# EAGLE design TDA5051A_DC_LC_PLCModem (EAGLE 9.4.2)
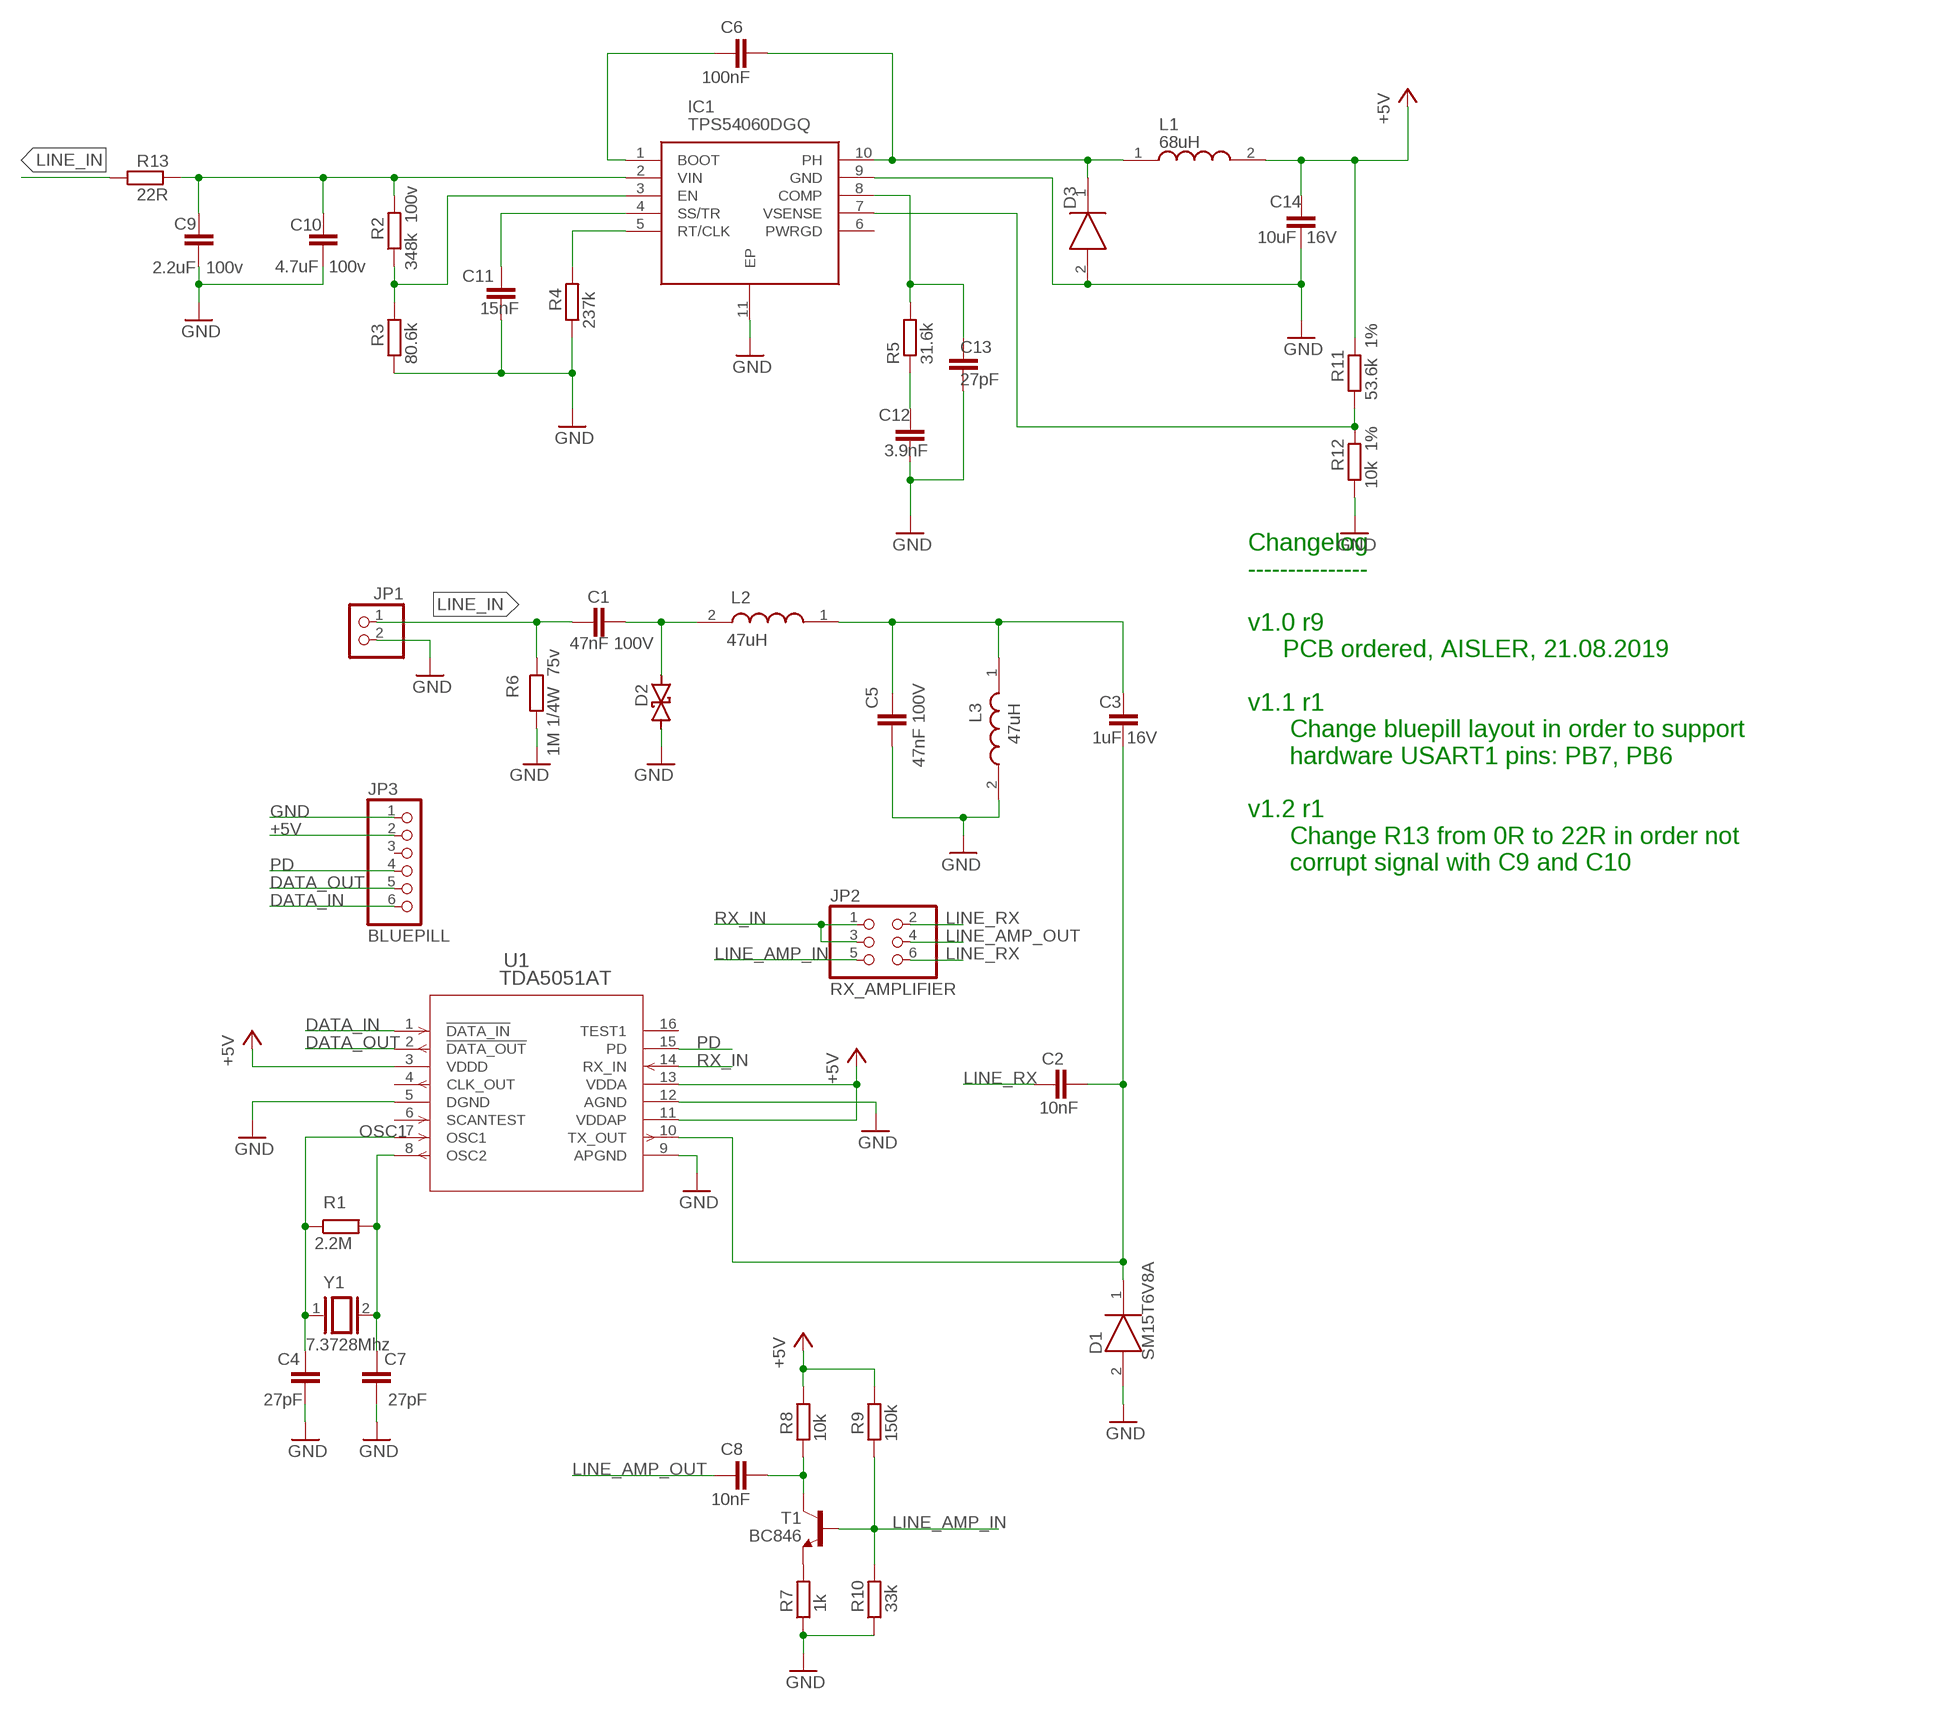
[diagram p0: schematic, sheet 1]

## Parts
C1  47nF 100V  C-EUC1206  [C1206]
C2  10nF  C-EUC0603  [C0603]
C3  1uF 16V  C-EUC0805  [C0805]
C4  27pF  C-EUC0603  [C0603]
C5  47nF 100V  C-EUC1206  [C1206]
C6  100nF  C-EUC0603  [C0603]
C7  27pF  C-EUC0603  [C0603]
C8  10nF  C-EUC0603  [C0603]
C9  2.2uF 100v  C-EUC1210  [C1210]
C10  4.7uF 100v  C-EUC1210  [C1210]
C11  15nF  C-EUC0603  [C0603]
C12  3.9nF  C-EUC0603  [C0603]
C13  27pF  C-EUC0603  [C0603]
C14  10uF 16V  C-EUC0603  [C0603]
D1  SM15T6V8A  [DIOM8059X265N]
D2  SM15T6V8CA  [DIOM8059X265N]
D3  STPS2H100A  [DIOM5126X265N]
IC1  TPS54060DGQ  [SOP50P490X110-11N]
JP1  PINHD-1X2  [1X02]
JP2  RX_AMPLIFIER  PINHD-2X3  [2X03]
JP3  BLUEPILL  PINHD-1X6  [1X06]
L1  68uH  SDR0805-680KL  [SDR0805-680KL]
L2  47uH  SDR1307-470KL  [SDR1307-220ML]
L3  47uH  SDR1307-470KL  [SDR1307-220ML]
R1  2.2M  R-EU_R0603  [R0603]
R2  348k 100v  R-EU_R0603  [R0603]
R3  80.6k  R-EU_R0603  [R0603]
R4  237k  R-EU_R0603  [R0603]
R5  31.6k  R-EU_R0603  [R0603]
R6  1M 1/4W 75v  R-EU_R0603  [R0603]
R7  1k  R-EU_R0603  [R0603]
R8  10k  R-EU_R0603  [R0603]
R9  150k  R-EU_R0603  [R0603]
R10  33k  R-EU_R0603  [R0603]
R11  53.6k 1%  R-EU_R0603  [R0603]
R12  10k 1%  R-EU_R0603  [R0603]
R13  22R  R-EU_R0603  [R0603]
T1  BC846  [SOT23]
U1  TDA5051AT  [SOT162-1]
Y1  7.3728Mhz  ABLS-7.3728MHZ-B2-T  [HC/49US_(AT49)]

## Nets
+5V [power]: C14.1 JP3.2 L1.2 R8.2 R9.2 R11.2 U1.3(VDDD) U1.11(VDDAP) U1.13(VDDA)
DATA_IN: JP3.6 U1.1(!DATA_IN)
DATA_OUT: JP3.5 U1.2(!DATA_OUT)
GND [power]: C4.1 C5.1 C7.1 C9.2 C10.2 C11.2 C12.2 C13.2 C14.2 D1.2(A) D2.2 D3.2(A) IC1.9(GND) IC1.11(EP) JP1.2 JP3.1 L3.2 R3.1 R4.1 R6.2 R7.1 R10.1 R12.1 U1.5(DGND) U1.9(APGND) U1.12(AGND)
LINE_AMP_IN: JP2.5 R9.1 R10.2 T1.1(B)
LINE_AMP_OUT: C8.1 JP2.4
LINE_IN [power]: C1.1 JP1.1 R6.1 R13.1
LINE_IN1 [power]: C9.1 C10.1 IC1.2(VIN) R2.2 R13.2
LINE_RX: C2.1 JP2.2 JP2.6
N$1: C2.2 C3.2 D1.1(K) U1.10(TX_OUT)
N$2 [power]: C1.2 D2.1 L2.2
N$3 [power]: C3.1 C5.2 L2.1 L3.1
N$4: C8.2 R8.1 T1.3(C)
N$5: C6.1 IC1.1(BOOT)
N$6 [power]: C6.2 D3.1(K) IC1.10(PH) L1.1
N$8: R7.2 T1.2(E)
N$10: C7.2 R1.2 U1.8(OSC2) Y1.2
N$11: IC1.3(EN) R2.1 R3.2
N$13: IC1.5(RT/CLK) R4.2
N$14: C11.1 IC1.4(SS/TR)
N$15: C12.1 R5.1
N$16: C13.1 IC1.8(COMP) R5.2
N$18: IC1.7(VSENSE) R11.1 R12.2
OSC1: C4.2 R1.1 U1.7(OSC1) Y1.1
PD: JP3.4 U1.15(PD)
RX_IN: JP2.1 JP2.3 U1.14(RX_IN)
Unconnected: IC1.6(PWRGD) JP3.3 U1.4(CLK_OUT) U1.6(SCANTEST)

## Notes on the sheet
- Changelog
  ---------------
  
  v1.0 r9
       PCB ordered, AISLER, 21.08.2019
  
  v1.1 r1
        Change bluepill layout in order to support
        hardware USART1 pins: PB7, PB6
  
  v1.2 r1
        Change R13 from 0R to 22R in order not
        corrupt signal with C9 and C10

## Power pins joined to a net without a drawn wire
TEST1: U1.16(TEST1)

## Library data of the parts
C1 C5 = rcl:C-EU: CAPACITOR, European symbol; MF: KEMET; MPN: C1206C473K1RACAUTO; OC_MOUSER: 80-C1206C473K1RAUTO; SPICEPREFIX: C
C2 C8 = rcl:C-EU: CAPACITOR, European symbol; MF: KEMET; MPN: C0603C103K5RACAUTO7411; OC_MOUSER: 80-C0603C103K5RAUTLR; SPICEPREFIX: C
C3 = rcl:C-EU: CAPACITOR, European symbol; MF: KEMET; MPN: C0805C105K4RACAUTO; OC_MOUSER: 80-C0805C105K4RAUTO; SPICEPREFIX: C
C4 C7 C13 = rcl:C-EU: CAPACITOR, European symbol; MF: AVX; MPN: 06035A270JAT2A; OC_MOUSER: 581-06035A270J; SPICEPREFIX: C
C6 = rcl:C-EU: CAPACITOR, European symbol; MF: KEMET; MPN: C0603C104K5RECAUTO; OC_MOUSER: 80-C0603C104K5REAUTO; SPICEPREFIX: C
C9 = rcl:C-EU: CAPACITOR, European symbol; MF: TDK; MPN: C3225X7R2A225K230AB; OC_MOUSER: 810-C3225X7R2A225K; SPICEPREFIX: C
C10 = rcl:C-EU: CAPACITOR, European symbol; MF: TDK; MPN: CGA6M3X7S2A475K200AB; OC_MOUSER: 810-CGA6M3X7S2A475K; SPICEPREFIX: C
C11 = rcl:C-EU: CAPACITOR, European symbol; MF: AVX; MPN: 06035C153KAT2A; OC_MOUSER: 581-06035C153K; SPICEPREFIX: C
C12 = rcl:C-EU: CAPACITOR, European symbol; MF: Murata Electronics; MPN: GCM1885C1H392JA16D; OC_MOUSER: 81-GCM1885C1H392JA6D; SPICEPREFIX: C
C14 = rcl:C-EU: CAPACITOR, European symbol; MF: Murata Electronics; MPN: GRM188R61C106KAALD; OC_MOUSER: 81-GRM188R61C106KALD; SPICEPREFIX: C
D1 = SM15T6V8A:SM15T6V8A: TVS Diode Uni-Directional SM15T6V8A 13.4V, 1500W, SMC 2-Pin Source: Datasheet <https://componentsearchengine.com/Datasheets/1/SM15T6V8A.pdf>; DESCRIPTION: TVS Diode Uni-Directional SM15T6V8A 13.4V, 1500W, SMC 2-Pin; HEIGHT: 2.65mm; MANUFACTURER_NAME: STMicroelectronics; MANUFACTURER_PART_NUMBER: SM15T6V8A; MF: STMicroelectronics; MOUSER_PART_NUMBER: 511-SM15T6V8A; MOUSER_PRICE-STOCK: https://www.mouser.com/Search/Refine.aspx?Keyword=511-SM15T6V8A; MPN: SM15T6V8A; OC_MOUSER: 511-SM15T6V8A
D2 = SM15T6V8CA:SM15T6V8CA: TVS Diode Bi-Directional SM15T6V8CA 13.4V, 1500W, SMC 2-Pin Source: Datasheet <https://componentsearchengine.com/Datasheets/1/SM15T6V8CA.pdf>; DESCRIPTION: TVS Diode Bi-Directional SM15T6V8CA 13.4V, 1500W, SMC 2-Pin; HEIGHT: 2.65mm; MANUFACTURER_NAME: STMicroelectronics; MANUFACTURER_PART_NUMBER: SM15T6V8CA; MF: STMicroelectronics; MOUSER_PART_NUMBER: 511-SM15T6V8CA; MOUSER_PRICE-STOCK: https://www.mouser.com/Search/Refine.aspx?Keyword=511-SM15T6V8CA; MPN: SM15T6V8CA; OC_MOUSER: 511-SM15T6V8CA
D3 = STPS2H100A:STPS2H100A: STPS2H100A, Schottky Diode, 2A max, 100V, 2-Pin, SMA Source: Datasheet <https://componentsearchengine.com/Datasheets/1/STPS2H100A.pdf>; DESCRIPTION: STPS2H100A, Schottky Diode, 2A max, 100V, 2-Pin, SMA; HEIGHT: 2.65mm; MANUFACTURER_NAME: STMicroelectronics; MANUFACTURER_PART_NUMBER: STPS2H100A; MF: STMicroelectronics; MOUSER_PART_NUMBER: 511-STPS2H100A; MOUSER_PRICE-STOCK: https://www.mouser.com/Search/Refine.aspx?Keyword=511-STPS2H100A; MPN: STPS2H100A; OC_MOUSER: 511-STPS2H100A
IC1 = TPS54060DGQ:TPS54060DGQ: 3.5V to 60V Input, 0.5A Step-Down Converter with Eco-Mode Source: Datasheet <http://www.ti.com/lit/ds/symlink/tps54060.pdf>; DESCRIPTION: 3.5V to 60V Input, 0.5A Step-Down Converter with Eco-Mode; HEIGHT: 1.1mm; MANUFACTURER_NAME: Texas Instruments; MANUFACTURER_PART_NUMBER: TPS54060DGQ; MF: Texas Instruments; MOUSER_PART_NUMBER: 595-TPS54060DGQ; MOUSER_PRICE-STOCK: https://www.mouser.com/Search/Refine.aspx?Keyword=595-TPS54060DGQ; MPN: TPS54060DGQR; OC_MOUSER: 595-TPS54060DGQR
JP1 = pinhead:PINHD-1X2: PIN HEADER; OC_MOUSER: unknown
JP2 = pinhead:PINHD-2X3: PIN HEADER; OC_MOUSER: unknown
JP3 = adafruit:PINHD-1X6: PIN HEADER; MF: Harwin; MPN: M20-7820646; OC_MOUSER: 855-M20-7820646
L1 = SDR0805-680KL:SDR0805-680KL: Bourns SDR0805 Series Wire-wound SMD Inductor with a Ferrite Core, 68uH +/-10% 850mA Idc Source: Datasheet <https://componentsearchengine.com/Datasheets/1/SDR0805-680KL.pdf>; DESCRIPTION: Bourns SDR0805 Series Wire-wound SMD Inductor with a Ferrite Core, 68 uH +/-10% 850mA Idc; HEIGHT: mm; MANUFACTURER_NAME: Bourns; MANUFACTURER_PART_NUMBER: SDR0805-680KL; MF: Bourns; MOUSER_PART_NUMBER: 652-SDR0805-680KL; MOUSER_PRICE-STOCK: https://www.mouser.com/Search/Refine.aspx?Keyword=652-SDR0805-680KL; MPN: SDR0805-680KL; OC_MOUSER: 652-SDR0805-680KL
L2 = SDR1307-470KL:SDR1307-470KL: BOURNS - SDR1307-470KL - INDUCTOR, 47UH, 10%, 2.7A, SMD Source: Datasheet <https://componentsearchengine.com/Datasheets/1/SDR1307-470KL.pdf>; DESCRIPTION: BOURNS - SDR1307A-470K - INDUCTOR, 47UH, 10%, 4.2A, SMD; HEIGHT: mm; MANUFACTURER_NAME: Bourns; MANUFACTURER_PART_NUMBER: SDR1307A-470K; MF: Bourns; MOUSER_PART_NUMBER: 652-SDR1307A-470K; MOUSER_PRICE-STOCK: https://www.mouser.com/Search/Refine.aspx?Keyword=652-SDR1307A-470K; MPN: SDR1307A-470K; OC_MOUSER: 652-SDR1307A-470K
L3 = SDR1307-470KL:SDR1307-470KL: BOURNS - SDR1307-470KL - INDUCTOR, 47UH, 10%, 2.7A, SMD Source: Datasheet <https://componentsearchengine.com/Datasheets/1/SDR1307-470KL.pdf>; DESCRIPTION: BOURNS - SDR1307A-470K - INDUCTOR, 47UH, 10%, 4.2A, SMD; HEIGHT: mm; MANUFACTURER_NAME: Bourns; MANUFACTURER_PART_NUMBER: SDR1307A-470K; MF: Bourns; MOUSER_PART_NUMBER: 652-SDR1307A-470K; MOUSER_PRICE-STOCK: https://www.mouser.com/Search/Refine.aspx?Keyword=652-SDR1307A-470K; MPN: SDR1307A-470K; OC_MOUSER: 652-SDR1307A-470K; SPICEPREFIX: L
R1 = rcl:R-EU_: RESISTOR, European symbol; MF: Yageo; MPN: RC0603JR-072M2L; OC_MOUSER: 603-RC0603JR-072M2L; SPICEPREFIX: R
R2 = rcl:R-EU_: RESISTOR, European symbol; MF: Susumu; MPN: RG1608P-3483-D-T5; OC_MOUSER: 754-RG1608P-3483DT5; SPICEPREFIX: R
R3 = rcl:R-EU_: RESISTOR, European symbol; MF: Vishay / Dale; MPN: CRCW060380K6FKEA; OC_MOUSER: 71-CRCW0603-80.6K-E3; SPICEPREFIX: R
R4 = rcl:R-EU_: RESISTOR, European symbol; MF: Yageo; MPN: AC0603FR-07237KL; OC_MOUSER: 603-AC0603FR-07237KL; SPICEPREFIX: R
R5 = rcl:R-EU_: RESISTOR, European symbol; MF: Yageo; MPN: AC0603FR-0731K6L; OC_MOUSER: 603-AC0603FR-0731K6L; SPICEPREFIX: R
R6 = rcl:R-EU_: RESISTOR, European symbol; MF: Vishay / Dale; MPN: RCS06031M00FKEA; OC_MOUSER: 71-RCS06031M00FKEA; SPICEPREFIX: R
R7 = rcl:R-EU_: RESISTOR, European symbol; MF: Vishay / Dale; MPN: CRCW06031K00FKEAC; OC_MOUSER: 71-CRCW06031K00FKEAC; SPICEPREFIX: R
R8 R12 = rcl:R-EU_: RESISTOR, European symbol; MF: Vishay / Dale; MPN: CRCW060310K0FKEAC; OC_MOUSER: 71-CRCW060310K0FKEAC; SPICEPREFIX: R
R9 = rcl:R-EU_: RESISTOR, European symbol; MF: Yageo; MPN: RC0603FR-07150KL; OC_MOUSER: 603-RC0603FR-07150KL; SPICEPREFIX: R
R10 = rcl:R-EU_: RESISTOR, European symbol; MF: Yageo; MPN: RC0603FR-0733KL; OC_MOUSER: 603-RC0603FR-0733KL; SPICEPREFIX: R
R11 = rcl:R-EU_: RESISTOR, European symbol; MF: Yageo; MPN: RC0603FR-0753K6L; OC_MOUSER: 603-RC0603FR-0753K6L; SPICEPREFIX: R
R13 = rcl:R-EU_: RESISTOR, European symbol; MF: Yageo; MPN: RC0603JR-070RL; OC_MOUSER: 603-RC0603JR-070RL; SPICEPREFIX: R
T1 = transistor:BC846: NPN TRANSISTOR; MF: ON Semiconductor; MPN: BC846BLT1G; OC_MOUSER: 863-BC846BLT1G; SPICEPREFIX: J
U1 = TDA5051A:TDA5051AT; MANUFACTURER_PART_NUMBER: TDA5051AT; MF: NXP Semiconductors; MPN: TDA5051AT/C1,518; OC_MOUSER: 771-TDA5051ATD-T; VENDOR: NXP
Y1 = ABLS-7.3728MHZ-B2-T:ABLS-7.3728MHZ-B2-T: Quarze +/-20ppm 7.3728 MHZ FUNDAMENTAL Source: Datasheet <https://componentsearchengine.com/Datasheets/1/ABLS-7.3728MHZ-B2-T.pdf>; DESCRIPTION: Quarze +/-20ppm 7.3728 MHZ FUNDAMENTAL; HEIGHT: mm; MANUFACTURER_NAME: ABRACON; MANUFACTURER_PART_NUMBER: ABLS-7.3728MHZ-B2-T; MF: ABRACON; MOUSER_PART_NUMBER: 815-ABLS-7.3728-B2; MOUSER_PRICE-STOCK: https://www.mouser.com/Search/Refine.aspx?Keyword=815-ABLS-7.3728-B2; MPN: ABLS-7.3728MHZ-B2-T; OC_MOUSER: 815-ABLS-7.3728-B2

## Net classes
0 default: width 0.203 mm
1 power: width 0.254 mm

## Board
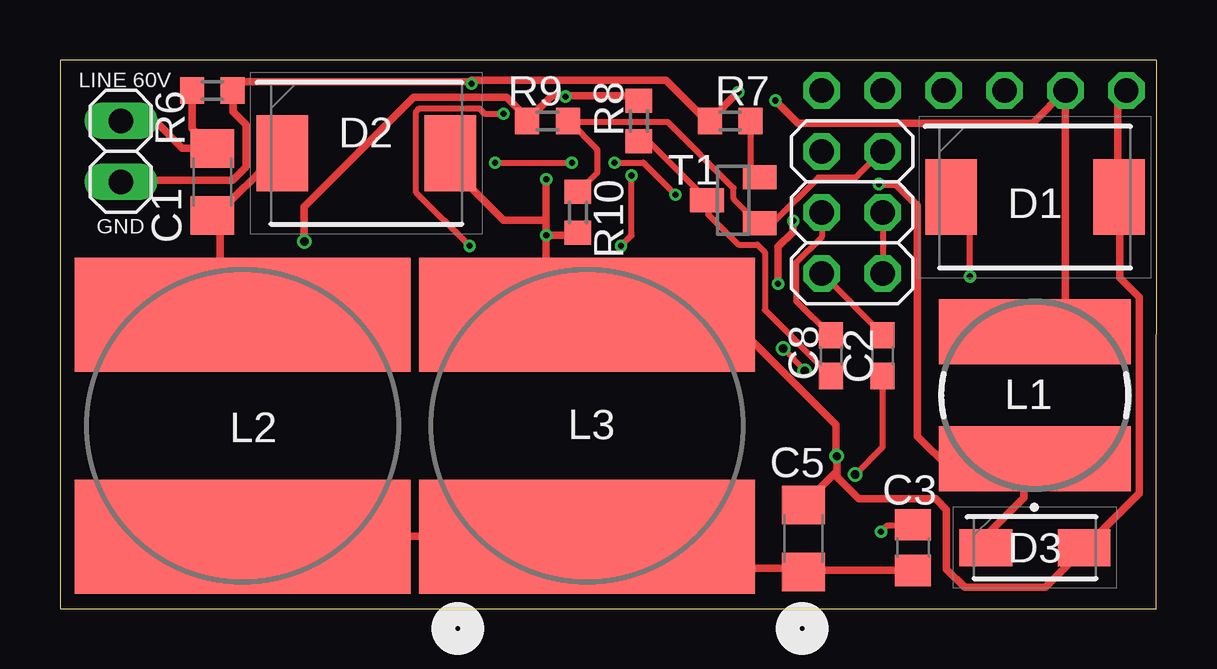
[diagram p1: board, top side]
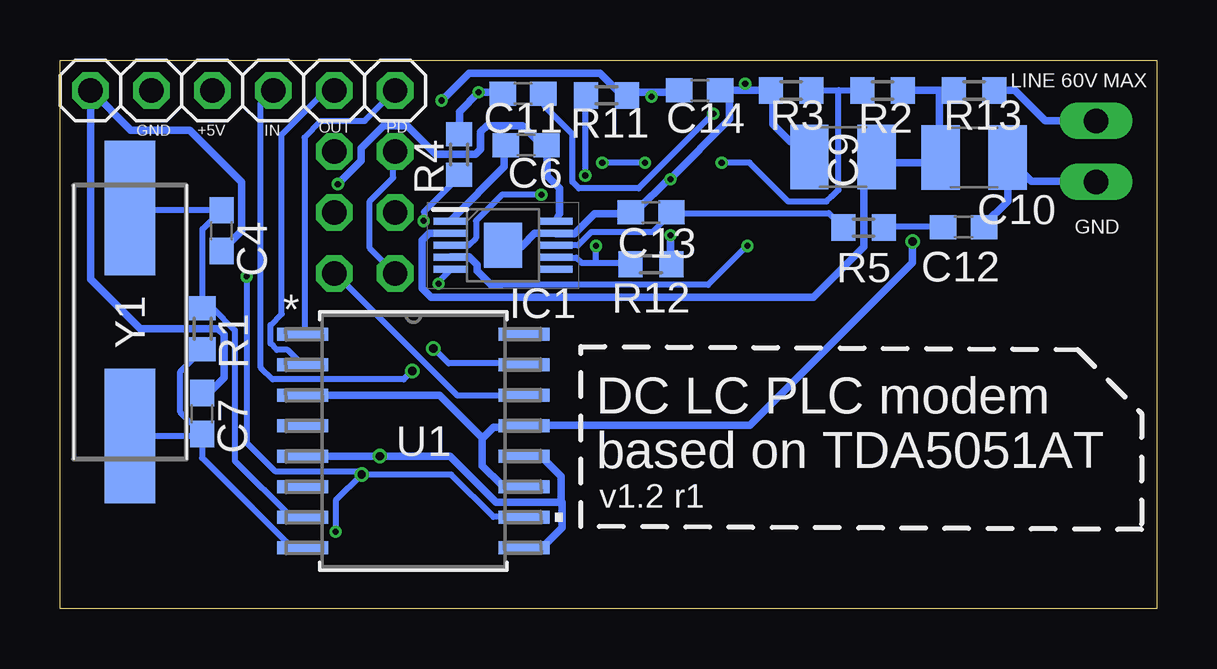
[diagram p2: board, bottom side, seen from below]

Size 45.72 x 22.86 mm. Coordinates in mm from the lower left corner, seen from the top.
Outline: 0,0 45.7,0 45.72,22.86 0,22.86 0,0
Copper layers (1*16): Top 0.035559375mm / dielectric 1.6mm / Bottom 0.035559375mm
Design rules "oshpark-2layer": minimum track width 6mil, minimum drill 10mil, track to track 6mil, track to pad 6mil, pad to pad 6mil, via to via 6mil, smd to smd 6mil, copper to edge 15mil, drill to drill 6mil, minimum pad ring 5mil, minimum via ring 5mil, stop-mask expansion 2.5mil, vias tented up to drill 0mil, thermal gap 10mil

### Footprints (pad centres in the part's own frame; a part is rotated, then mirrored left to right if it is on the bottom)
C1206 = smd 1.6 x 1.8: 1 -1.4,0; 2 1.4,0
C0603 = smd 1.1 x 1: 1 -0.85,0; 2 0.85,0
C0805 = smd 1.3 x 1.5: 1 -0.95,0; 2 0.95,0
C1210 = smd 1.6 x 2.7: 1 -1.4,0; 2 1.4,0
DIOM8059X265N = smd 2.15 x 3.15: 1 -3.5,0; 2 3.5,0
DIOM5126X265N = smd 2.2 x 1.55: 1 -2.05,0; 2 2.05,0
SOP50P490X110-11N = smd 1.4 x 0.3: 1 -2.2,1; 2 -2.2,0.5; 3 -2.2,0; 4 -2.2,-0.5; 5 -2.2,-1; 6 2.2,-1; 7 2.2,-0.5; 8 2.2,0; 9 2.2,0.5; 10 2.2,1 | smd 1.57 x 1.88: 11 0,0
1X02 = drill 1.016 long: 1 -1.27,0; 2 1.27,0
2X03 = drill 1.016 octagon: 1 -2.54,-1.27; 2 -2.54,1.27; 3 0,-1.27; 4 0,1.27; 5 2.54,-1.27; 6 2.54,1.27
1X06 = drill 1.016 octagon: 1 -6.35,0; 2 -3.81,0; 3 -1.27,0; 4 1.27,0; 5 3.81,0; 6 6.35,0
SDR0805-680KL = smd 8 x 2.7: 1 0,2.65; 2 0,-2.65
SDR1307-220ML = smd 14 x 4.75: 1 0,4.625; 2 0,-4.625
R0603 = smd 1 x 1.1: 1 -0.85,0; 2 0.85,0
SOT23 = smd 1 x 1.4: 1 -0.95,-1.1; 2 0.95,-1.1; 3 0,1.1
SOT162-1 = smd 2.121 x 0.533: 1 -4.616,4.445; 2 -4.616,3.175; 3 -4.616,1.905; 4 -4.616,0.635; 5 -4.616,-0.635; 6 -4.616,-1.905; 7 -4.616,-3.175; 8 -4.616,-4.445; 9 4.616,-4.445; 10 4.616,-3.175; 11 4.616,-1.905; 12 4.616,-0.635; 13 4.616,0.635; 14 4.616,1.905; 15 4.616,3.175; 16 4.616,4.445
HC/49US_(AT49) = smd 5.6 x 2.1: 1 -4.75,0; 2 4.75,0

### Placement (x,y rotation side)
C1  6.35,17.78 270 top
C2  34.29,10.54 270 top
C3  35.56,2.54 90 top
C4  38.99,15.75 90 bottom
C5  30.99,2.92 270 top
C6  26.29,19.3 0 bottom
C7  39.8,8.13 270 bottom
C8  32.13,10.54 270 top
C9  13.08,18.82 180 bottom
C10  7.62,18.8 0 bottom
C11  26.42,21.46 180 bottom
C12  8.05,15.9 0 bottom
C13  21.08,16.51 180 bottom
C14  19.05,21.59 0 bottom
D1  40.64,17.14 0 top
D2  12.78,18.97 0 top
D3  40.64,2.54 0 top
IC1  27.25,15.14 0 bottom
JP1  2.54,19.05 270 top
JP2  33.02,16.51 90 top
JP3  38.1,21.59 0 bottom
L1  40.64,8.89 180 top
L2  7.62,7.62 180 top
L3  21.97,7.62 180 top
R1  39.78,11.66 270 bottom
R2  11.43,21.59 0 bottom
R3  15.24,21.59 0 bottom
R4  29.08,18.92 270 bottom
R5  12.22,15.88 180 bottom
R6  6.35,21.59 0 top
R7  27.94,20.32 0 top
R8  24.13,20.32 90 top
R9  20.32,20.32 180 top
R10  21.59,16.51 90 top
R11  22.94,21.39 0 bottom
R12  21.08,14.35 180 bottom
R13  7.62,21.59 180 bottom
T1  28.07,17.02 90 top
U1  30.99,6.99 0 bottom
Y1  42.8,11.94 270 bottom

### Tracks (layer width: path | path; a pad name or v marks a point on that pad's centre or on a via)
+5V  (via drill 0.25, 0.35)
  Top 0.305: R8.2 23.94,21.36 21.09,21.36 v21.07,21.34 21.04,21.36 20.51,21.36 R9.2 19.47,20.45 18.61,21.31 14.74,21.31 10.19,16.75 v10.19,15.29 | v29.82,21.17 30.76,20.23 40.55,20.23 JP3.2 41.91,12.81 L1.2
  Bottom 0.305: 28.11,7.1 27.65,7.56 26.4,7.56 U1.13 26.31,7.64 16.95,7.64 10.19,14.41 v10.19,15.29 | U1.11 26.4,5.16 27.32,5.16 28.12,5.96 28.12,7.09 28.11,7.1 | U1.3 29.9,8.89 28.11,7.1 | 21.07,21.51 22.08,21.51 R11.2 22.22,21.6 22.49,21.6 23.2,22.31 28.68,22.31 v29.82,21.17 | 21.07,21.51 19.91,21.51 C14.1 | v21.07,21.34 21.07,21.51
DATA_IN
  Bottom 0.254: JP3.6 33.02,20.32 34.85,20.32 35.53,19.64 35.53,11.51 U1.1
DATA_OUT
  Bottom 0.254: U1.2 36.23,10.78 36.68,10.78 36.94,11.05 36.94,11.81 36.47,12.28 36.47,19.74 34.62,21.59 JP3.5
GND  (via drill 0.25, 0.35)
  Top 0.305: v28.27,21.51 27.11,20.36 R7.1 27.03,20.45 26.82,20.45 25.26,22.01 17.16,22.01 17.16,21.96 | 17.16,21.96 7.64,21.96 7.29,21.6 R6.2 7.2,21.51 7.23,21.49 7.23,20.7 7.76,20.17 7.76,18.4 7.2,17.84 2.6,17.84 JP1.2 | v17.16,21.87 17.16,21.96 | v20.27,15.56 20.27,16.09 20.18,16.18 18.49,16.18 16.28,18.39 D2.2 | v20.27,15.56 20.26,15.54 20.26,13.97 21.96,12.27 L3.2 27.76,12.24 32.34,7.66 32.34,6.31 v32.38,6.35 | 42.76,2.58 44.98,4.8 44.98,12.98 44.18,13.78 44.18,17.07 D1.2 44.09,17.16 44.09,21.23 JP3.1 | 42.76,2.58 D3.2 | v32.38,6.35 32.38,5.49 33.3,4.57 36.5,4.57 36.96,4.12 36.96,1.65 37.72,0.89 41.07,0.89 42.76,2.58 | v32.38,6.35 32.38,5.72 C5.1 | v20.27,15.56 21.49,15.56 R10.1 | v20.27,15.56 v20.27,17.89
  Bottom 0.305: IC1.11 27.2,15.09 26.48,15.09 25.93,15.63 IC1.9 25.04,15.62 24.27,15.62 23.44,16.45 21.96,16.45 C13.2 21.74,16.51 20.27,17.98 20.27,17.92 | 17.16,21.6 18.14,21.6 C14.2 17.8,21.47 17.8,20.38 20.27,17.92 | 17.16,21.6 16.09,21.6 R3.1 16,21.51 16,20.18 15.28,19.46 C9.2 | C12.2 7.2,15.99 6.22,16.97 C10.2 5.23,17.8 2.56,17.8 JP1.2 | C11.2 27.29,21.51 v28.27,21.51 29.07,20.71 29.07,19.82 R4.1 | v17.16,21.87 17.16,21.6 | C7.1 39.52,8.98 38.88,9.63 38.88,11.43 39.12,11.67 42.38,11.67 44.44,13.73 44.44,21.58 JP3.1 44.42,21.59 42.77,19.94 40.31,19.94 38.14,17.77 38.14,15.75 38.94,14.95 38.94,14.94 C4.1 | 24.83,4.43 24.83,5.52 25.62,6.31 26.31,6.31 U1.12 | U1.9 26.31,2.58 25.59,2.58 24.8,3.37 24.8,4.43 24.83,4.43 | 24.83,4.43 27.53,4.43 29.45,6.35 v32.38,6.35 U1.5 | v20.27,15.56 20.27,14.4 R12.1 | v20.27,17.89 20.27,17.92
LINE_AMP_IN
  Top 0.254: R10.2 22.39,18.16 22.39,19.14 21.21,20.32 R9.1 21.34,20.27 25.34,20.27 28.08,17.53 28.08,17.08 29.07,16.09 T1.1 29.25,16.09 29.74,16.09 31.61,17.96 33.16,17.96 34.23,19.02 JP2.5
LINE_AMP_OUT
  Top 0.254: JP2.4 31.75,15.48 30.68,14.41 30.68,12.84 C8.1
LINE_IN
  Top 0.305: R6.1 5.51,21.51 5.51,20 6.31,19.2 C1.1 5.1,19.18 3.96,20.32 JP1.1
  Bottom 0.305: R13.1 5.92,21.59 4.65,20.32 JP1.1
LINE_IN1
  Bottom 0.305: 9.07,21.6 10.58,21.6 R2.2 | 9.07,21.6 8.53,21.6 R13.2 | 9.07,21.6 9.07,18.83 C10.1 9.79,18.58 11.14,18.58 C9.1 11.71,18.34 12.22,17.83 12.22,15.07 14.31,12.98 30.25,12.98 30.62,13.35 30.62,15.35 30.34,15.63 IC1.2
LINE_RX
  Top 0.254: JP2.2 34.29,11.43
  Top 0.305: 34.29,11.43 C2.1
  Bottom 0.254: JP2.2 32.8,15.02 32.8,16.98 31.83,17.96 31.83,19.02 JP2.6
N$1  (via drill 0.25, 0.35)
  Top 0.254: v34.23,3.2 34.49,3.47 35.56,3.47 C3.2 | v37.94,13.84 37.94,16.2 37.1,17.04 37.1,17.1 D1.1 | v33.15,5.59 34.29,6.73 C2.2
  Bottom 0.254: U1.10 26.4,3.82 27.65,3.82 29.41,5.59 v33.15,5.59 | v37.94,13.84 37.94,6.91 36.75,5.73 33.29,5.73 v33.15,5.59 | v33.15,5.59 34.23,4.51 v34.23,3.2
N$2
  Top 0.305: D2.1 8.86,18.73 6.58,16.45 6.4,16.45 C1.2 6.67,16.36 6.67,13.16 7.56,12.27 L2.2
N$3
  Top 0.305: C3.1 31.03,1.6 C5.2 30.73,1.69 23.29,1.69 22.05,2.93 L3.1 21.87,3.02 7.64,3.02 L2.1
N$4
  Top 0.254: R8.1 24.18,19.47 24.54,19.47 26.94,17.07 T1.3 27.03,16.98 27.03,16.42 28.28,15.16 29.07,15.16 29.38,14.86 29.38,12.45 C8.2
N$5
  Bottom 0.305: C6.1 27.2,19.29 27.2,18.4 29.38,16.22 IC1.1
N$6  (via drill 0.25)
  Top 0.305: 40.18,5.78 40.63,6.22 L1.1 | D3.1 38.67,2.58 38.67,3.11 40.18,4.62 40.18,5.78 | v34.14,17.69 34.84,17.69 35.74,16.79 35.74,7.19 37.15,5.78 40.18,5.78
  Bottom 0.305: IC1.10 24.89,16.45 24.89,17.51 25.43,18.05 25.43,19.29 C6.2 25.51,19.38 25.69,19.38 26.43,20.12 27.93,20.12 28.18,19.86 28.18,19.15 28.4,18.94 30.06,18.94 31.24,20.12 32.23,20.12 33.17,19.18 33.17,18.66 v34.14,17.69
N$8
  Top 0.254: R7.2 28.8,20.27 28.8,18.4 29.16,18.05 T1.2
N$10
  Bottom 0.254: C7.2 39.83,7.23 39.83,7.2 42.76,7.2 Y1.2 | U1.8 35.65,2.58 36.09,2.58 39.8,6.29 C7.2 | C7.2 40.71,8.19 40.71,9.88 R1.2
N$11  (via drill 0.25)
  Top 0.254: v25.65,17.25 24.32,18.58 v23.11,18.58 | v18.14,18.58 v21.34,18.58
  Bottom 0.254: 13.27,21.6 14.31,21.6 R3.2 | 13.27,21.6 12.36,21.6 R2.1 | IC1.3 28.69,15.14 28.38,15.44 28.38,16.15 27.29,17.25 v25.65,17.25 | v21.34,18.58 v23.11,18.58 | v18.14,18.58 16.98,18.58 15.37,16.97 13.77,16.97 13.57,17.17 13.55,17.17 13.27,17.45 13.27,17.58 13.27,21.6
N$13  (via drill 0.25)
  Top 0.305: v29.93,13.54 29.93,15.07 30.54,15.68 30.54,16.13 v30.57,16.15
  Bottom 0.254: v30.57,16.15 30.54,16.18 30.54,16.54 29.16,17.92 29.16,18.05 R4.2 | v29.93,13.54 29.93,13.63 29.46,14.1 IC1.5
N$14  (via drill 0.25)
  Top 0.254: v18.49,20.62 17.69,20.62 17.48,20.84 14.97,20.84 14.85,20.71 14.85,17.34 v17.07,15.11
  Bottom 0.254: v18.49,20.62 21.6,17.51 24.09,17.51 24.36,17.78 24.36,19.77 25.51,20.93 25.51,21.43 C11.1 | v17.07,15.11 v17.08,15.11 18.71,13.49 27.34,13.49 | IC1.4 29.44,14.66
  Bottom 0.305: 29.44,14.66 28.66,14.66 28.34,14.34 28.34,14.07 27.76,13.49 27.34,13.49
N$15
  Bottom 0.254: R5.1 11.32,15.93 8.93,15.93 C12.1
N$16
  Bottom 0.254: R5.2 13.68,16.48 20.21,16.48 C13.1 20.27,16.45 21.03,15.68 23.58,15.68 24.13,15.14 IC1.8
N$18  (via drill 0.25)
  Top 0.254: v23.82,18.05 23.82,15.56 v23.38,15.11
  Bottom 0.254: 23.38,14.4 23.98,14.4 24.21,14.63 IC1.7 | 23.38,14.4 21.96,14.4 R12.2 | v23.82,18.05 23.82,21.26 R11.1 | 23.38,14.4 v23.38,15.11
OSC1
  Bottom 0.254: R1.1 39.33,12.51 38.43,11.61 38.43,6.16 36.09,3.82 35.65,3.82 U1.7 | R1.1 | Y1.1 42.76,16.62 42.73,16.6 C4.2 39.78,15.81 R1.1
PD  (via drill 0.35)
  Top 0.254: v30.15,10.85 31.04,9.96 v31.04,9.91
  Bottom 0.254: U1.15 26.4,10.22 29.52,10.22 30.14,10.85 v30.15,10.85 | v31.04,9.91 31.39,9.55 36.85,9.55 37.35,10.05 37.35,21.07 JP3.4
RX_IN
  Top 0.254: JP2.3 34.31,16.45 34.31,14.05 JP2.1
  Bottom 0.254: U1.14 29.16,8.89 34.23,13.96 JP2.1

### Text on the board
tPlace: LINE 60V | GND
bPlace: LINE 60V MAX | PD | OUT | IN | +5V | GND | GND | DC LC PLC modem / based on TDA5051AT | v1.2 r1